# EAGLE design tornado-shield (EAGLE 7.6.0)
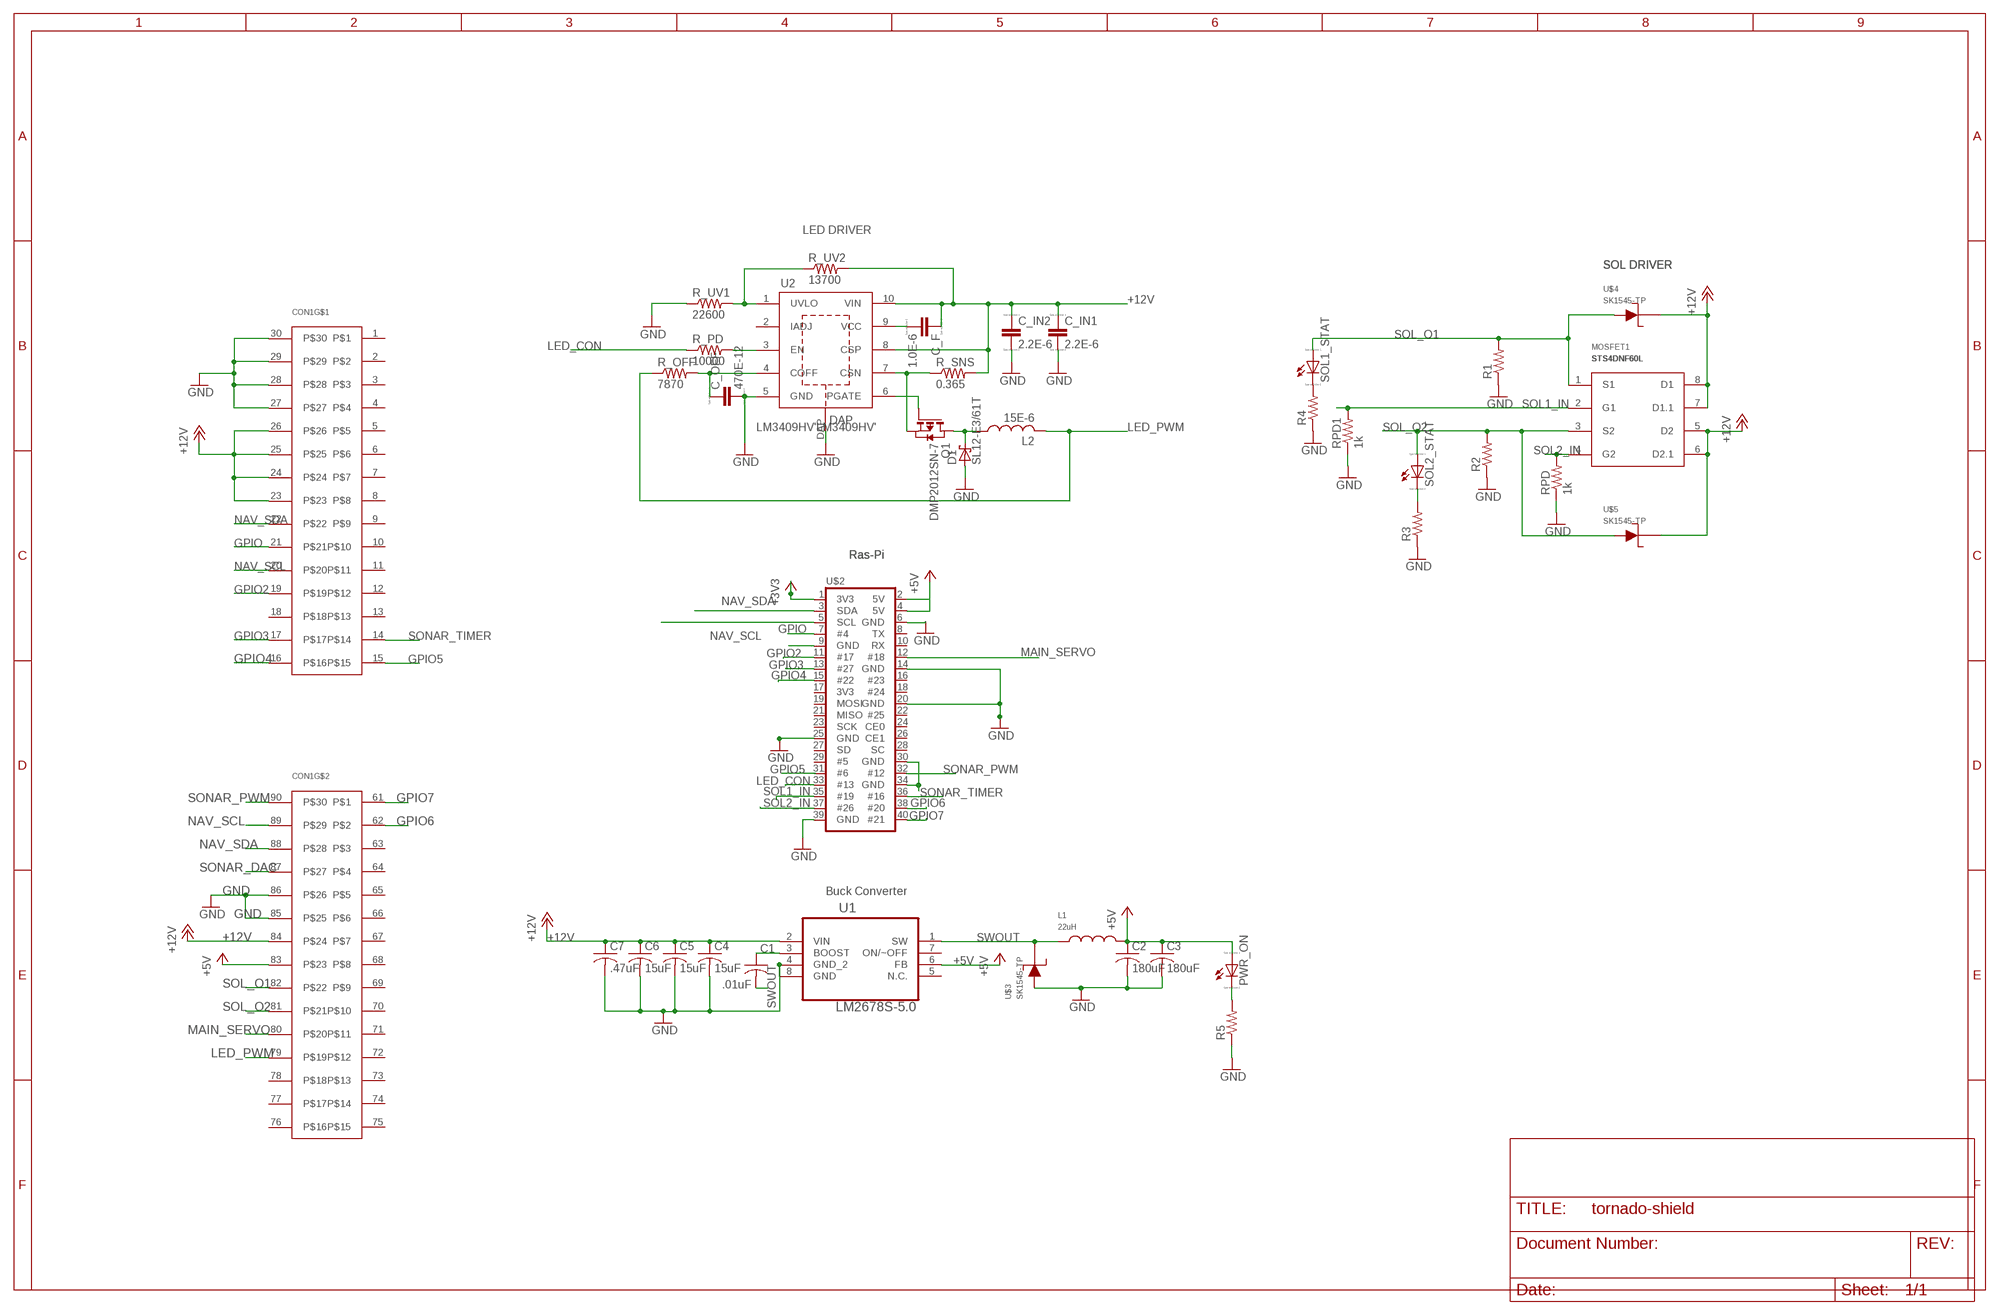
[diagram p0: schematic, sheet 1]

## Parts
C1  .01uF  C-USC0603  [C0603]
C2  180uF  C-USC0603  [C0603]
C3  180uF  C-USC0603  [C0603]
C4  15uF  C-USC0603  [C0603]
C5  15uF  C-USC0603  [C0603]
C6  15uF  C-USC0603  [C0603]
C7  .47uF  C-USC0603  [C0603]
C_F  1.0E-6  CC0603  [C0603]
C_IN1  2.2E-6  CC0603  [C0603]
C_IN2  2.2E-6  CC0603  [C0603]
C_OFF  470E-12  CC0402  [C0402]
CON1  ROV_SHIELD_V2  [ROV_SHIELD_V2]
D1  SL12-E3/61T  [SL12-E3/61T]
L1  22uH  L_7443551221  [7443551221]
L2  15E-6  SRN8040  [SRN8040]
MOSFET1  STS4DNF60L  [SO08]
PWR_ON  LED_ESML0603  [LED_SML0603]
Q1  DMP2012SN-7  [DMP2012SN-7]
R1  R-US_R0603  [R0603]
R2  R-US_R0603  [R0603]
R3  R-US_R0603  [R0603]
R4  R-US_R0603  [R0603]
R5  R-US_R0603  [R0603]
R_OFF  7870  R-US_R0603  [R0603]
R_PD  10000  R-US_R0603  [R0603]
R_SNS  0.365  R-US_R2512  [R2512]
R_UV1  22600  R-US_R0603  [R0603]
R_UV2  13700  R-US_R0603  [R0603]
RPD  1k  R-US_R0603  [R0603]
RPD1  1k  R-US_R0603  [R0603]
SOL1_STAT  LED_ESML0603  [LED_SML0603]
SOL2_STAT  LED_ESML0603  [LED_SML0603]
U1  LM2678S-5.0  [TO127P1435X457-8N]
U2  LM3409HV'LM3409HV'  [VSSOP-10]
U$2  RASPBERRY-PI-2  [RASPBERRY-PI-2]
U$3  SK1545-TP  [DO-214AB]
U$4  SK1545-TP  [DO-214AB]
U$5  SK1545-TP  [DO-214AB]

## Nets
+3V3: U$2.1(3V3)
+5V: C2.1 C3.1 CON1.83 L1.P$2 PWR_ON.A U1.6(FB) U$2.2(5V) U$2.4(5V)
+12V: C4.1 C5.1 C6.1 C7.1 C_F.1 C_IN1.1 C_IN2.1 CON1.23 CON1.24 CON1.25 CON1.26 CON1.84 MOSFET1.5(D2) MOSFET1.6(D2.1) MOSFET1.7(D1.1) MOSFET1.8(D1) R_SNS.2 R_UV2.2 U1.2(VIN) U2.8(CSP) U2.10(VIN) U$4.P$2 U$5.P$2
GND: C2.2 C3.2 C4.2 C5.2 C6.2 C7.2 C_IN1.2 C_IN2.2 C_OFF.2 CON1.27 CON1.28 CON1.29 CON1.30 CON1.85 CON1.86 D1.2(A) R1.1 R2.1 R3.1 R4.1 R5.1 R_UV1.1 RPD1.1 RPD.1 U1.4(GND_2) U1.8(GND) U2.5(GND) U2.DAP U$2.6(GND) U$2.9(GND) U$2.14(GND) U$2.20(GND) U$2.25(GND) U$2.30(GND) U$2.34(GND) U$2.39(GND) U$3.P$1
GPIO: CON1.21 U$2.7(#4)
GPIO2: CON1.19 U$2.11(#17)
GPIO3: CON1.17 U$2.13(#27)
GPIO4: CON1.16 U$2.15(#22)
GPIO5: CON1.15 U$2.31(#6)
GPIO6: CON1.62 U$2.38(#20)
GPIO7: CON1.61 U$2.40(#21)
L1: D1.1(C) L2.1 Q1.1(D)
LED_CON: R_PD.1 U$2.33(#13)
LED_PWM: CON1.79 L2.2 R_OFF.1
MAIN_SERVO: CON1.80 U$2.12(#18)
N$1: C_OFF.1 R_OFF.2 U2.4(COFF)
N$2: R_UV1.2 R_UV2.1 U2.1(UVLO)
N$3: C1.1 U1.3(BOOST)
N$4: C_F.2 U2.9(VCC)
N$5: R_PD.2 U2.3(EN)
N$7: Q1.2(G) U2.6(PGATE)
N$8: Q1.3(S) R_SNS.1 U2.7(CSN)
N$9: R4.2 SOL1_STAT.C
N$12: PWR_ON.C R5.2
NAV_SCL: CON1.20 CON1.89 U$2.5(SCL)
NAV_SDA: CON1.22 CON1.88 U$2.3(SDA)
SOL1_IN: MOSFET1.2(G1) RPD1.2 U$2.35(#19)
SOL2_IN: MOSFET1.4(G2) RPD.2 U$2.37(#26)
SOL2_STAT: R3.2 SOL2_STAT.C
SOL_O1: CON1.82 MOSFET1.1(S1) R1.2 SOL1_STAT.A U$4.P$1
SOL_O2: CON1.81 MOSFET1.3(S2) R2.2 SOL2_STAT.A U$5.P$1
SONAR_DAC: CON1.87
SONAR_PWM: CON1.90 U$2.32(#12)
SONAR_TIMER: CON1.14 U$2.36(#16)
SWOUT: C1.2 L1.P$1 U1.1(SW) U$3.P$2
Unconnected: CON1.1 CON1.2 CON1.3 CON1.4 CON1.5 CON1.6 CON1.7 CON1.8 CON1.9 CON1.10 CON1.11 CON1.12 CON1.13 CON1.18 CON1.63 CON1.64 CON1.65 CON1.66 CON1.67 CON1.68 CON1.69 CON1.70 CON1.71 CON1.72 CON1.73 CON1.74 CON1.75 CON1.76 CON1.77 CON1.78 U1.5(N.C.) U1.7(ON/~OFF) U2.2(IADJ) U$2.8(TX) U$2.10(RX) U$2.16(#23) U$2.17(3V3) U$2.18(#24) U$2.19(MOSI) U$2.21(MISO) U$2.22(#25) U$2.23(SCK) U$2.24(CE0) U$2.26(CE1) U$2.27(SD) U$2.28(SC) U$2.29(#5)

## Notes on the sheet
- LED DRIVER
- SOL DRIVER | SOL DRIVER
- Ras-Pi | Ras-Pi
- Buck Converter

## Library data of the parts
C1-C7 = rcl:C-US: CAPACITOR, American symbol
C_F C_IN1 C_IN2 C_OFF = eagle-ltspice:C: CAPACITOR, European symbol; SPICEMODEL: NONE; SPICEPREFIX: C
CON1 = rovconnectors:ROV_SHIELD_V2
D1 = DiscreteComponents:SL12-E3/61T
L1 = samssuperhot:L_7443551221
L2 = DiscreteComponents:SRN8040
MOSFET1 = st-microelectronics:STS4DNF60L
PWR_ON SOL1_STAT SOL2_STAT = eagle-ltspice:LED_E: LED Source: http://www.osram.convergy.de Source: www.luxeon.com Source: www.kingbright.com; SPICEMODEL: NONE; SPICEPREFIX: D; SPICETYPE: diode
Q1 = DiscreteComponents:DMP2012SN-7
R1-R5 = rcl:R-US_: RESISTOR, American symbol
R_OFF R_PD R_SNS R_UV1 R_UV2 RPD RPD1 = DiscreteComponents:R-US_: RESISTOR, American symbol
U1 = LM2678S-5.0:LM2678S-5.0: IC BUCK 5V 5A
U2 = 2015_LED_Driver:LM3409HV
U$2 = Ai_Boards:RASPBERRY-PI-2
U$3-U$5 = samssuperhot:SK1545-TP

## Board
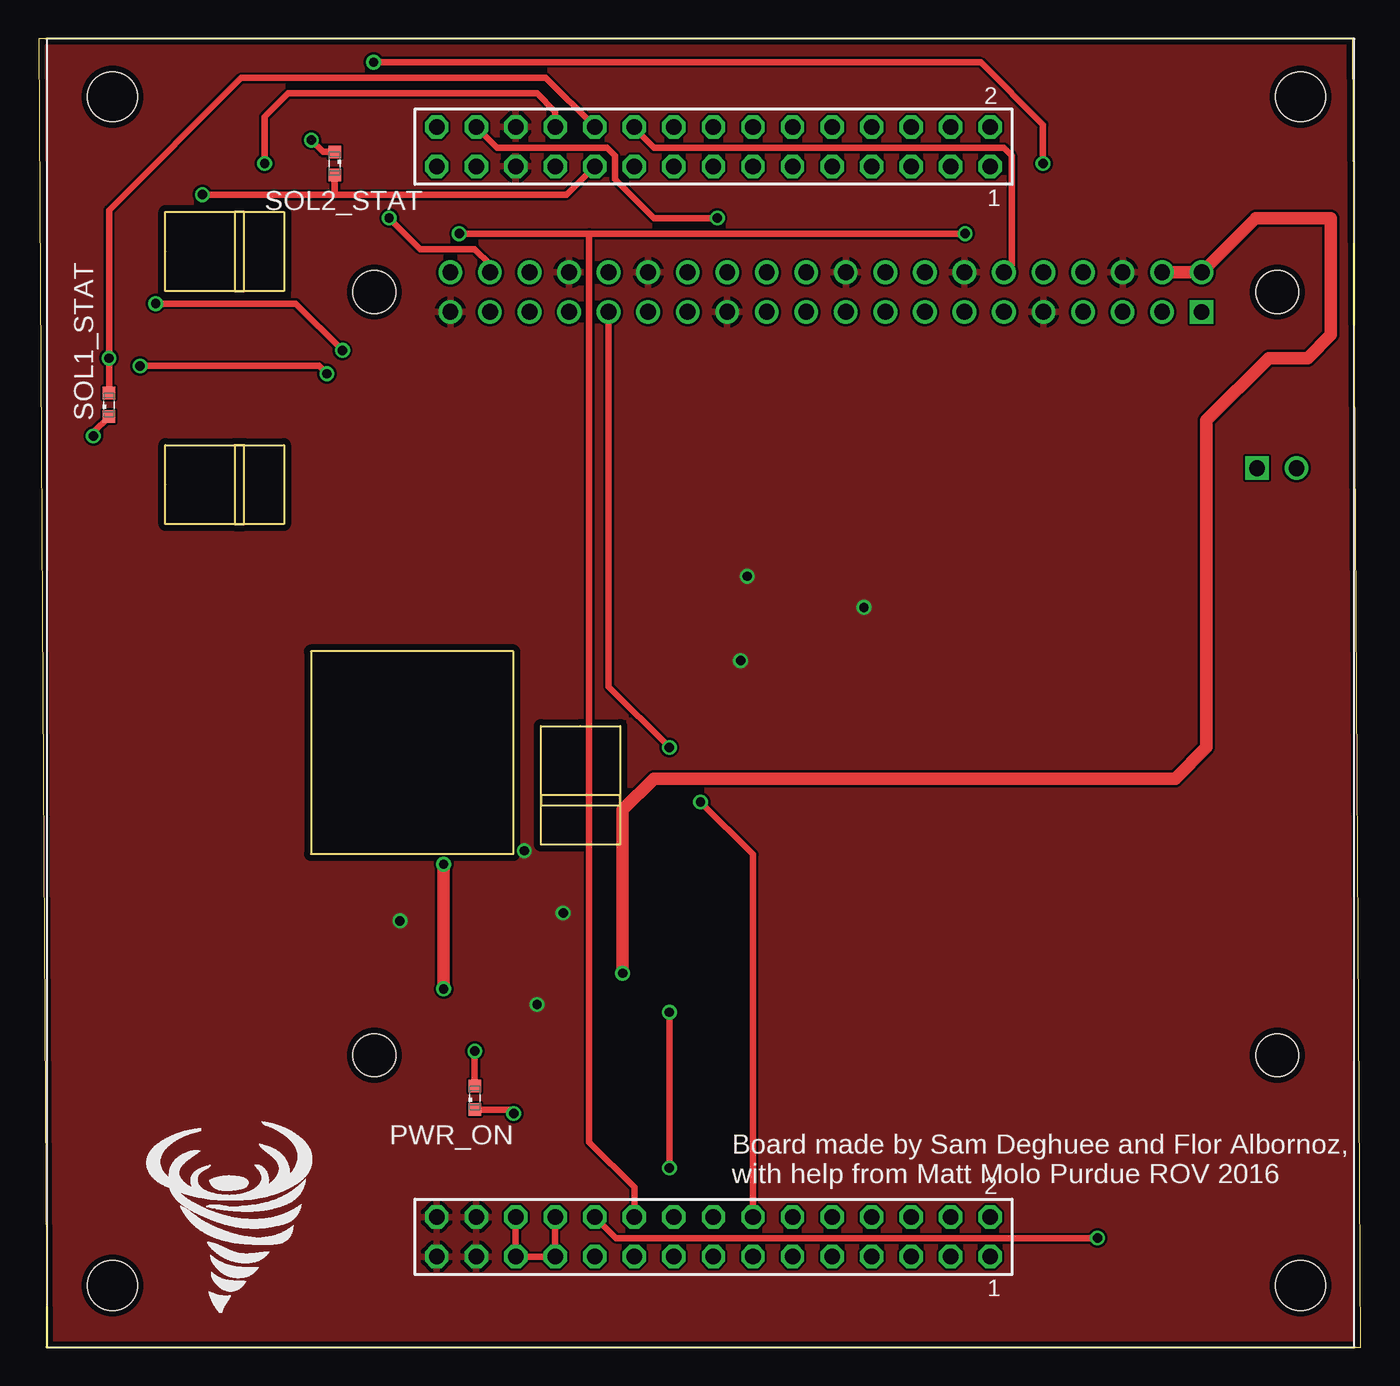
[diagram p1: board, top side]
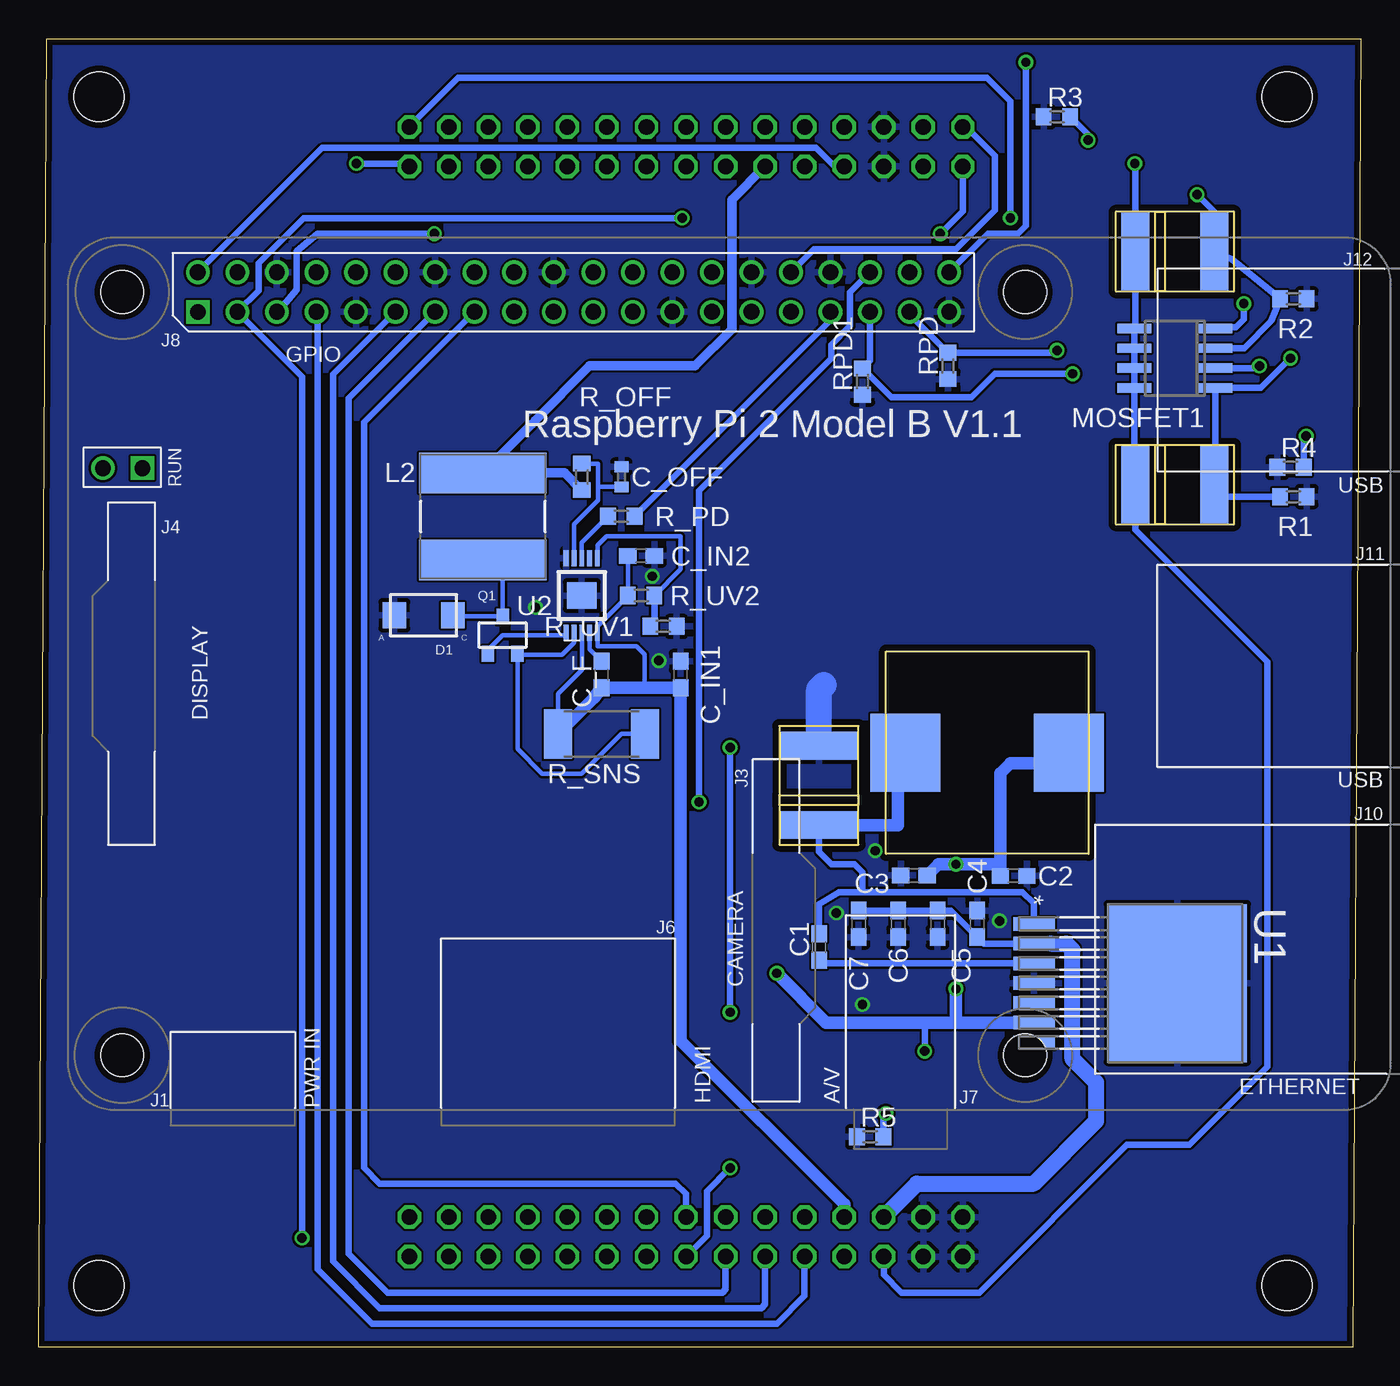
[diagram p2: board, bottom side, seen from below]

Size 84.9 x 84 mm. Coordinates in mm from the lower left corner, seen from the top.
Outline: 0.5,0 84.9,0 84.4,84 0,84 0.5,0
Copper layers (1*16): Top 0.0356mm / dielectric 1.5011mm / Bottom 0.0356mm
Design rules "PCBs_io": minimum track width 6mil, minimum drill 13mil, track to track 6mil, track to pad 6mil, pad to pad 6mil, via to via 6mil, smd to smd 6mil, copper to edge 15mil, drill to drill 6mil, minimum pad ring 7mil, minimum via ring 7mil, stop-mask expansion 3mil, vias tented up to drill 0mil, thermal gap 10mil

### Footprints (pad centres in the part's own frame; a part is rotated, then mirrored left to right if it is on the bottom)
C0603 = smd 1.1 x 1: 1 -0.85,0; 2 0.85,0
C0402 = smd 0.7 x 0.9: 1 -0.65,0; 2 0.65,0
ROV_SHIELD_V2 = drill 1 pad 1.5 octagon: 1 60.61,5.81; 2 60.61,8.35; 3 58.07,5.81; 4 58.07,8.35; 5 55.53,5.81; 6 55.53,8.35; 7 52.99,5.81; 8 52.99,8.35; 9 50.45,5.81; 10 50.45,8.35; 11 47.91,5.81; 12 47.91,8.35; 13 45.37,5.81; 14 45.37,8.35; 15 42.83,5.81; 16 42.83,8.35; 17 40.29,5.81; 18 40.29,8.35; 19 37.75,5.81; 20 37.75,8.35; 21 35.21,5.81; 22 35.21,8.35; 23 32.67,5.81; 24 32.67,8.35; 25 30.13,5.81; 26 30.13,8.35; 27 27.59,5.81; 28 27.59,8.35; 29 25.05,5.81; 30 25.05,8.35; 61 60.61,75.81; 62 60.61,78.35; 63 58.07,75.81; 64 58.07,78.35; 65 55.53,75.81; 66 55.53,78.35; 67 52.99,75.81; 68 52.99,78.35; 69 50.45,75.81; 70 50.45,78.35; 71 47.91,75.81; 72 47.91,78.35; 73 45.37,75.81; 74 45.37,78.35; 75 42.83,75.81; 76 42.83,78.35; 77 40.29,75.81; 78 40.29,78.35; 79 37.75,75.81; 80 37.75,78.35; 81 35.21,75.81; 82 35.21,78.35; 83 32.67,75.81; 84 32.67,78.35; 85 30.13,75.81; 86 30.13,78.35; 87 27.59,75.81; 88 27.59,78.35; 89 25.05,75.81; 90 25.05,78.35 | hole 3.2: 4.215,80.288; 4.215,3.955; 80.547,3.955; 80.547,80.288
SL12-E3/61T = smd 1.524 x 1.676: 1 -1.88,0; 2 1.88,0
7443551221 = smd 4.5 x 5: P$1 -5.25,0; P$2 5.25,0
SRN8040 = smd 2.6 x 8.2: 1 -2.8,0; 2 2.8,0
SO08 = smd 0.6 x 2.2: 1 -1.905,-2.6; 2 -0.635,-2.6; 3 0.635,-2.6; 4 1.905,-2.6; 5 1.905,2.6; 6 0.635,2.6; 7 -0.635,2.6; 8 -1.905,2.6
LED_SML0603 = smd 0.8 x 0.8: A 0.75,0; C -0.75,0
DMP2012SN-7 = smd 0.8 x 1: 1 0,1.2; 2 -0.95,-1.2; 3 0.95,-1.2
R0603 = smd 1 x 1.1: 1 -0.85,0; 2 0.85,0
R2512 = smd 1.8 x 3.2: 1 -2.8,0; 2 2.8,0
TO127P1435X457-8N = smd 0.864 x 2.692: 1 -3.81,-9.042; 2 -2.54,-9.042; 3 -1.27,-9.042; 4 0,-9.042; 5 1.27,-9.042; 6 2.54,-9.042; 7 3.81,-9.042 | smd 10.16 x 8.941: 8 0,0.152
VSSOP-10 = smd 0.305 x 1.016: 1 -1.001,-2.4; 2 -0.5,-2.4; 3 0,-2.4; 4 0.5,-2.4; 5 1.001,-2.4; 6 1.001,2.4; 7 0.5,2.4; 8 0,2.4; 9 -0.5,2.4; 10 -1.001,2.4 | smd 1.905 x 1.727: DAP 0,0
RASPBERRY-PI-2 = drill 1.016 square: 1 8.37,51.23; P$41 4.8,41.2 | drill 1.016: 2 8.357,53.772; 3 10.897,51.232; 4 10.897,53.772; 5 13.437,51.232; 6 13.437,53.772; 7 15.977,51.232; 8 15.977,53.772; 9 18.517,51.232; 10 18.517,53.772; 11 21.057,51.232; 12 21.057,53.772; 13 23.597,51.232; 14 23.597,53.772; 15 26.137,51.232; 16 26.137,53.772; 17 28.677,51.232; 18 28.677,53.772; 19 31.217,51.232; 20 31.217,53.772; 21 33.757,51.232; 22 33.757,53.772; 23 36.297,51.232; 24 36.297,53.772; 25 38.837,51.232; 26 38.837,53.772; 27 41.377,51.232; 28 41.377,53.772; 29 43.917,51.232; 30 43.917,53.772; 31 46.457,51.232; 32 46.457,53.772; 33 48.997,51.232; 34 48.997,53.772; 35 51.537,51.232; 36 51.537,53.772; 37 54.077,51.232; 38 54.077,53.772; 39 56.617,51.232; 40 56.617,53.772; P$42 2.26,41.2 | hole 2.75: 3.5,3.5; 61.5,3.5; 3.5,52.5; 61.5,52.5
DO-214AB = smd 1.778 x 5.08: P$1 -2.54,0; P$2 2.54,0

### Placement (x,y rotation side)
C1  34.79,25.68 90 bottom
C2  22.29,30.25 0 bottom
C3  28.69,30.29 180 bottom
C4  24.63,27.18 90 bottom
C5  27.17,27.18 270 bottom
C6  29.71,27.18 270 bottom
C7  32.25,27.18 270 bottom
C_F  48.76,43.18 90 bottom
C_IN1  43.68,43.18 90 bottom
C_IN2  46.22,50.8 0 bottom
C_OFF  47.49,55.88 90 bottom
CON1  0.5,0 0 top
D1  60.19,46.99 180 bottom
L1  23.98,38.17 0 bottom
L2  56.38,53.34 90 bottom
MOSFET1  11.93,63.5 90 bottom
PWR_ON  28,16 90 top
Q1  55.11,45.72 0 bottom
R1  4.31,54.61 180 bottom
R2  4.31,67.31 180 bottom
R3  19.5,79 0 bottom
R4  4.5,56.5 0 bottom
R5  31.5,13.5 0 bottom
R_OFF  50.03,55.88 90 bottom
R_PD  47.49,53.34 180 bottom
R_SNS  48.76,39.37 180 bottom
R_UV1  44.78,46.28 180 bottom
R_UV2  46.22,48.26 180 bottom
RPD  26.5,63 90 bottom
RPD1  32,62 90 bottom
SOL1_STAT  4.5,60.5 90 top
SOL2_STAT  19,76 270 top
U1  11.93,23.37 270 bottom
U2  50.03,48.26 180 bottom
U$2  83.05,15.24 0 bottom
U$3  34.79,36.07 270 bottom
U$4  11.93,55.38 180 bottom
U$5  11.93,70.35 180 bottom

### Tracks (layer width: path | path; a pad name or v marks a point on that pad's centre or on a via)
+5V  (via drill 0.6)
  Top 0.406: v28,19 PWR_ON.A
  Top 0.813: U$2.4 U$2.2 78.18,72.5 83,72.5 83,65 81.5,63.5 79,63.5 75,59.5 75,38.5 73,36.5 39.5,36.5 37.5,34.5 v37.5,24 | v26,31 v26,23
  Bottom 0.406: CON1.83 33.81,75.81 35,77 66.7,77 U$2.2 | 26,20.83 28,20.83 v28,19
  Bottom 0.813: U1.6 26,20.83 | 26,20.83 34.33,20.83 v37.5,24 | v26,23 26,20.83 | 23.14,31 v26,31 27.13,31 C3.1 | 23.14,31 C2.1 | 23.14,31 23.14,36.86 22.5,37.5 19.4,37.5 L1.P$2
+12V  (via drill 0.6)
  Top 0.406: CON1.24 CON1.23 CON1.25 CON1.26 | v14.5,76 14.5,79 16,80.5 32,80.5 33.17,79.33 CON1.84
  Bottom 0.305: 51.3,39.63 R_SNS.2 51.56,41.94 50,43.5 50,45.83 U2.8 | C_IN2.1 R_UV2.2 49.03,46.3 U2.10 49.03,45 46.5,45 46,44.5 46,42.33
  Bottom 0.406: C7.1 C6.1 C5.1 26.33,28.03 C4.1 24.21,25.91 U1.2 19.91,25.91 | CON1.25 30.63,4.63 29.5,3.5 24.5,3.5 15,13 11,13 6,18 6,44 14.47,52.47 U$4.P$2 14.53,55.94 MOSFET1.8 MOSFET1.7 MOSFET1.6 MOSFET1.5 14.47,65.47 U$5.P$2 14.47,75.97 v14.5,76 | CON1.26 30.63,8.37
  Bottom 0.813: CON1.24 33.17,9.17 43.68,19.68 C_IN1.1 46,42.33 C_F.1 49.26,41.67 51.3,39.63
  Bottom 1.016: 30.63,8.37 28.5,10.5 21,10.5 17,14.5 17,17 18.5,18.5 18.5,25.5 18.91,25.91 19.91,25.91
GND  (via drill 0.6)
  Bottom 1.016: U$3.P$1 34,38.61
  Bottom 1.676: U$3.P$1 34.79,42.21 34.5,42.5
  other vias: 53,47.5 45.5,49.5 45.08,44.08 33.68,27.87 32,22 23.19,27.37 31.18,31.87
  pour Bottom: 0.5,84 84.5,84 84.5,0 0.5,0
  pour Top: 0.5,0 85,0 85,84 0.5,84
GPIO
  Bottom 0.406: U$2.7 67,66.4 67,5 63.5,1.5 37.5,1.5 35.71,3.29 CON1.21
GPIO2
  Bottom 0.406: CON1.19 38.25,2.75 38.5,2.5 63,2.5 66,5.5 66,62.47 U$2.11
GPIO3
  Bottom 0.406: CON1.17 40.79,3.71 41,3.5 62.5,3.5 65,6 65,60.92 U$2.13
GPIO4
  Bottom 0.406: CON1.16 43.33,9.83 44,10.5 63,10.5 64,11.5 64,59.38 U$2.15
GPIO5  (via drill 0.6)
  Top 0.406: U$2.31 36.59,42.41 v40.5,38.5 | v40.5,21.5 v40.5,11.5
  Bottom 0.406: v40.5,38.5 v40.5,21.5 | v40.5,11.5 42,10 42,7.14 CON1.15
GPIO6  (via drill 0.6)
  Top 0.406: U$2.38 28.97,69.53 28,70.5 24.5,70.5 v22.5,72.5
  Bottom 0.406: CON1.62 57.96,81.5 24,81.5 22.5,80 v22.5,72.5
GPIO7  (via drill 0.6)
  Top 0.406: v64.5,76 64.5,78.5 60.5,82.5 v21.5,82.5
  Bottom 0.406: CON1.61 61.3,76 v64.5,76 | v21.5,82.5 21.5,72 22,71.5 23.95,71.5 U$2.40
L1
  Bottom 0.305: D1.1 58.24,46.92 Q1.1 55.11,50.8 56.12,50.8 L2.1
LED_CON
  Bottom 0.406: R_PD.1 34.05,65.93 U$2.33
LED_PWM
  Bottom 0.406: 53.04,59.48 53.26,59.26
  Bottom 0.61: R_OFF.1 51.14,56.14 L2.2 53.26,59.26 | 53.04,59.48 49.52,63 42.75,63 40.37,65.37 40.37,73.69 CON1.79
MAIN_SERVO
  Top 0.406: CON1.80 38.25,78.25 39.5,77 62,77 62.5,76.5 62.5,69.5 62.01,69.01 U$2.12
N$1
  Bottom 0.305: R_OFF.2 48.99,56.73 48.99,55.23 | U2.4 50.53,52.84 48.99,54.38 48.99,55 48.99,55.23 | C_OFF.1 48.99,55.23
N$2
  Bottom 0.305: R_UV2.1 43.68,49.95 43.68,52.07 48.43,52.07 49,51.5 49,50.69 U2.1
  Bottom 0.406: R_UV1.2 arc-90 45.37,46.54 R_UV2.1
N$3
  Bottom 0.406: U1.3 34.79,24.64 C1.1
N$4
  Bottom 0.305: U2.9 49.53,44.8 C_F.2
N$5
  Bottom 0.305: U2.3 50.03,51.65 R_PD.2
N$7
  Bottom 0.305: Q1.2 56.06,44.77 55.11,45.72 51.17,45.72 U2.6
N$8
  Bottom 0.305: U2.7 50.53,45.22 51.3,44.45 54.09,44.45 Q1.3 54.16,38.42 52.57,36.83 50.03,36.83 47.49,39.37 R_SNS.1
N$9  (via drill 0.6)
  Top 0.406: SOL1_STAT.C 3.5,58.75 v3.5,58.5
  Bottom 0.406: v3.5,58.5 3.65,58.35 R4.2
N$12  (via drill 0.6)
  Top 0.406: PWR_ON.C 30.5,15.25 v30.5,15
  Bottom 0.406: v30.5,15 30.65,15 R5.2
NAV_SCL  (via drill 0.6)
  Top 0.406: v27,71.5 35.35,71.5 | 35.35,71.5 v59.5,71.5 | 35.35,71.5 35.35,13.15 38.25,10.25 CON1.20
  Bottom 0.406: CON1.89 25.55,72.95 v27,71.5 | U$2.5 69.53,66.47 68.36,67.88 68.36,70.38 67,71.5 v59.5,71.5
NAV_SDA  (via drill 0.6)
  Top 0.406: v43.58,72.5 39.5,72.5 37,75 37,76.5 36.5,77 29.44,77 CON1.88 | v68,7 37.06,7 CON1.22
  Bottom 0.406: v43.58,72.5 67.88,72.5 70.79,69.6 70.79,67.84 U$2.3 68,62.32 v68,7
SOL1_IN  (via drill 0.6)
  Top 0.406: v6.5,63 18,63 v18.5,62.5
  Bottom 0.406: U$2.35 31.51,63.34 RPD1.2 | MOSFET1.2 6.63,62.87 v6.5,63 | 31.85,63 RPD1.2 | v18.5,62.5 23.5,62.5 25,61 30.15,61 RPD1.2
SOL2_IN  (via drill 0.6)
  Top 0.406: v19.5,64 16.5,67 v7.5,67
  Bottom 0.406: U$2.37 28.97,66.32 RPD.2 19.65,63.85 v19.5,64 | v7.5,67 7.5,66 8,65.5 9.23,65.5 MOSFET1.4
SOL2_STAT  (via drill 0.6)  (1 unrouted)
  Top 0.406: SOL2_STAT.C 18.25,76.75 v17.5,77.5
  Bottom 0.406: R3.2 17.5,77.85 v17.5,77.5
SOL_O1  (via drill 0.6)
  Top 0.406: CON1.82 32.56,81.5 13,81.5 4.5,73 v4.5,63.5 SOL1_STAT.A
  Bottom 0.406: R1.2 9.39,54.61 U$4.P$1 9.33,55.88 MOSFET1.1 6.41,61.59 v4.5,63.5
SOL_O2  (via drill 0.6)
  Top 0.406: v10.5,74 19,74 | 19,74 33.9,74 CON1.81 | SOL2_STAT.A 19,74
  Bottom 0.406: MOSFET1.3 7.49,64.14 5.73,65.89 R2.2 8.27,69.85 U$5.P$1 9.39,72.89 v10.5,74
SONAR_PWM
  Bottom 0.406: CON1.90 25.35,78.35 23.5,76.5 23.5,73 26,70.5 35.1,70.5 U$2.32
SONAR_TIMER  (via drill 0.6)
  Top 0.406: CON1.14 45.87,31.63 v42.5,35
  Bottom 0.406: v42.5,35 42.5,55 34,63.5 34,64.36 32.79,65.57 32.79,67.73 U$2.36
SWOUT
  Bottom 0.406: 32,29.22 21.72,29.22 21,28.5 21,27.21 U1.1 | 32,29.22 33.52,29.22 34.79,28.45 C1.2 | U$3.P$2 34.79,31.79 34,31 32.5,31 32,30.5 32,29.22
  Bottom 0.813: U$3.P$2 34,33.53 34,33.5 29.73,33.5 29.73,38.17 L1.P$1

### Text on the board
tPlace: Board made by Sam Deghuee and Flor Albornoz, / with help from Matt Molo Purdue ROV 2016